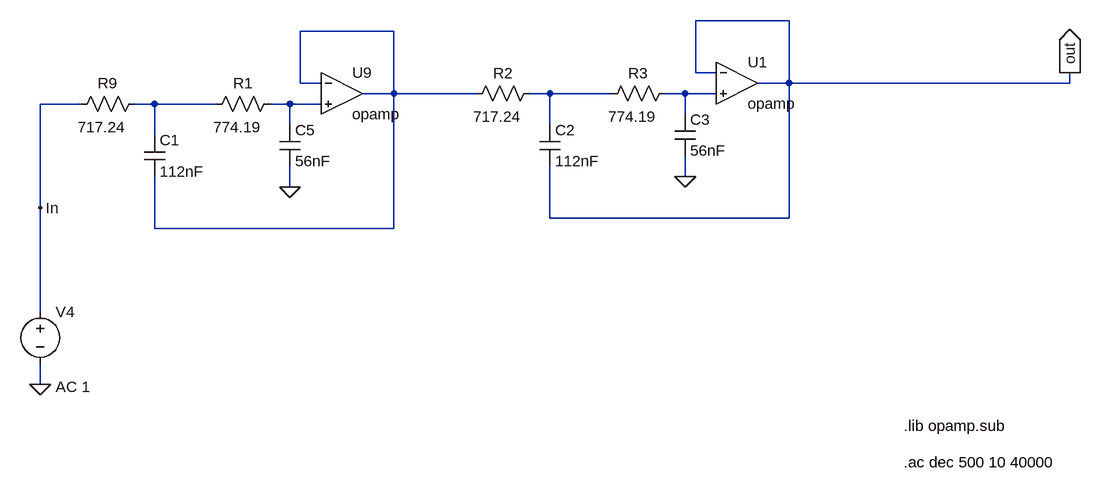
[diagram p0: schematic lowpass-ltspice.asc]
lowpass-ltspice.asc, the LTspice schematic file:
Version 4
SHEET 1 1268 792
WIRE -1056 -416 -1200 -416
WIRE -1664 -400 -1808 -400
WIRE -1200 -336 -1200 -416
WIRE -1168 -336 -1200 -336
WIRE -1808 -320 -1808 -400
WIRE -1776 -320 -1808 -320
WIRE -1056 -320 -1056 -416
WIRE -1056 -320 -1104 -320
WIRE -624 -320 -624 -336
WIRE -624 -320 -1056 -320
WIRE -1664 -304 -1664 -400
WIRE -1664 -304 -1712 -304
WIRE -1536 -304 -1664 -304
WIRE -1424 -304 -1456 -304
WIRE -1328 -304 -1424 -304
WIRE -1216 -304 -1248 -304
WIRE -1168 -304 -1216 -304
WIRE -2144 -288 -2208 -288
WIRE -2032 -288 -2064 -288
WIRE -1936 -288 -2032 -288
WIRE -1824 -288 -1856 -288
WIRE -1776 -288 -1824 -288
WIRE -1216 -272 -1216 -304
WIRE -1824 -256 -1824 -288
WIRE -1424 -256 -1424 -304
WIRE -2032 -240 -2032 -288
WIRE -1216 -176 -1216 -208
WIRE -1824 -160 -1824 -192
WIRE -2208 -128 -2208 -288
WIRE -1424 -112 -1424 -192
WIRE -1056 -112 -1056 -320
WIRE -1056 -112 -1424 -112
WIRE -2032 -96 -2032 -176
WIRE -1664 -96 -1664 -304
WIRE -1664 -96 -2032 -96
WIRE -2208 32 -2208 -128
WIRE -2208 144 -2208 112
FLAG -2208 144 0
FLAG -624 -336 out
IOPIN -624 -336 Out
FLAG -2208 -128 In
FLAG -1824 -160 0
FLAG -1216 -176 0
SYMBOL voltage -2208 16 R0
WINDOW 123 24 132 Left 2
WINDOW 39 0 0 Left 2
SYMATTR Value2 AC 1
SYMATTR InstName V4
SYMATTR Value ""
SYMBOL res -2048 -304 R90
WINDOW 0 0 56 VBottom 2
WINDOW 3 36 65 VTop 2
SYMATTR InstName R9
SYMATTR Value 717.24
SYMBOL opamp -1744 -368 R0
SYMATTR InstName U9
SYMBOL cap -2048 -240 R0
SYMATTR InstName C1
SYMATTR Value 112nF
SYMBOL res -1840 -304 R90
WINDOW 0 0 56 VBottom 2
WINDOW 3 36 65 VTop 2
SYMATTR InstName R1
SYMATTR Value 774.19
SYMBOL cap -1840 -256 R0
SYMATTR InstName C5
SYMATTR Value 56nF
SYMBOL res -1440 -320 R90
WINDOW 0 0 56 VBottom 2
WINDOW 3 36 65 VTop 2
SYMATTR InstName R2
SYMATTR Value 717.24
SYMBOL opamp -1136 -384 R0
SYMATTR InstName U1
SYMBOL cap -1440 -256 R0
SYMATTR InstName C2
SYMATTR Value 112nF
SYMBOL res -1232 -320 R90
WINDOW 0 0 56 VBottom 2
WINDOW 3 36 65 VTop 2
SYMATTR InstName R3
SYMATTR Value 774.19
SYMBOL cap -1232 -272 R0
SYMATTR InstName C3
SYMATTR Value 56nF
TEXT -880 264 Left 2 !.ac dec 500 10 40000
TEXT -880 208 Left 2 !.lib opamp.sub

The netlist it stands for:
* lowpass-ltspice.asc
V4 In 0 AC 1
R9 N004 In 717.24
XU9 N001 N005 N001 opamp Aol=100K GBW=10Meg  ; pins invin noninvin out
C1 N004 N001 112nF
R1 N005 N004 774.19
C5 N005 0 56nF
R2 N002 N001 717.24
XU1 out N003 out opamp Aol=100K GBW=10Meg  ; pins invin noninvin out
C2 N002 out 112nF
R3 N003 N002 774.19
C3 N003 0 56nF
.ac dec 500 10 40000
.lib opamp.sub
.backanno
.end